# Altium schematic sheet gydrodrive_interfaces.SchDoc
size 297 x 209 mm; SheetNumber: 13; SheetTotal: 22
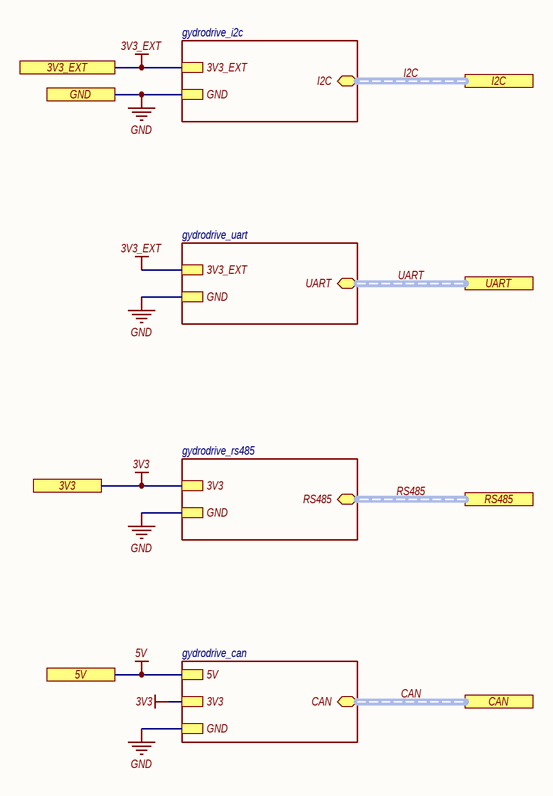
[diagram p0: gydrodrive_interfaces.SchDoc]

## Sub-sheets
C = gydrodrive_can: CAN (bidir, harness CAN), GND, 5V, 3V3
I = gydrodrive_i2c: I2C (bidir, harness I2C), 3V3_EXT, GND
R = gydrodrive_rs485: RS485 (bidir, harness RS485), GND, 3V3
U = gydrodrive_uart: UART (bidir, harness UART), GND, 3V3_EXT

## Ports
3V3 (see gydrodrive_main[1A], gydrodrive_button[3B], gydrodrive_can[3B], gydrodrive_debugger[3B], gydrodrive_encoder[2A], gydrodrive_indication[4C], gydrodrive_inputTrim[4B], gydrodrive_mcu[4C], gydrodrive_rs485[4B], gydrodrive_sto[3B], gydrodrive_supply[5B]), 3V3_EXT (see gydrodrive_main[1A], gydrodrive_i2c[5B], gydrodrive_reservedPins[4B], gydrodrive_supply[5B], gydrodrive_uart[4B]), 5V (see gydrodrive_main[1A], gydrodrive_can[4B], gydrodrive_currentSource[2C], gydrodrive_discreteControl[3B], gydrodrive_supply[5A]), CAN (harness CAN, see gydrodrive_main[2A], gydrodrive_can[1C], gydrodrive_mcu[1C]), GND (see gydrodrive_main[1A], gydrodrive_button[3C], gydrodrive_can[3C], gydrodrive_control[3B], gydrodrive_currentSource[2B], gydrodrive_debugger[4C], gydrodrive_discreteControl[3B], gydrodrive_encoder[2A], gydrodrive_i2c[5C], gydrodrive_indication[4C], gydrodrive_inputTrim[4C], gydrodrive_linearPosSensor[2C], gydrodrive_mcu[6D], gydrodrive_reservedPins[4B], gydrodrive_rs485[3B], gydrodrive_sensor[3C], gydrodrive_sensors[2B], gydrodrive_sto[3C], gydrodrive_supply[2C], gydrodrive_uart[4C]), I2C (harness I2C, see gydrodrive_main[2A], gydrodrive_i2c[1C], gydrodrive_mcu[1B]), RS485 (harness RS485, see gydrodrive_main[2A], gydrodrive_mcu[1C], gydrodrive_rs485[1B]), UART (harness UART, see gydrodrive_main[2A], gydrodrive_mcu[1B], gydrodrive_uart[3B])

## Nets
3V3: port 3V3, sheet R/3V3, sheet C/3V3
3V3_EXT: port 3V3_EXT, sheet I/3V3_EXT, sheet U/3V3_EXT
5V: port 5V, sheet C/5V
GND: port GND, sheet I/GND, sheet U/GND, sheet R/GND, sheet C/GND

## Buses and harness runs
harness CAN = port CAN = sheet C/CAN
harness I2C = port I2C = sheet I/I2C
harness RS485 = port RS485 = sheet R/RS485
harness UART = port UART = sheet U/UART

## Notes on the sheet
- Подп. и дата
- Инв. № дубл.
- Взам. инв. №
- Инв. № подл.
- Изм.
- Лист
- № докум.
- Подп.
- Дата
- Копировал
- Формат
- A4